# Altium schematic sheet Temp.SchDoc: main_assy PCB
size A4
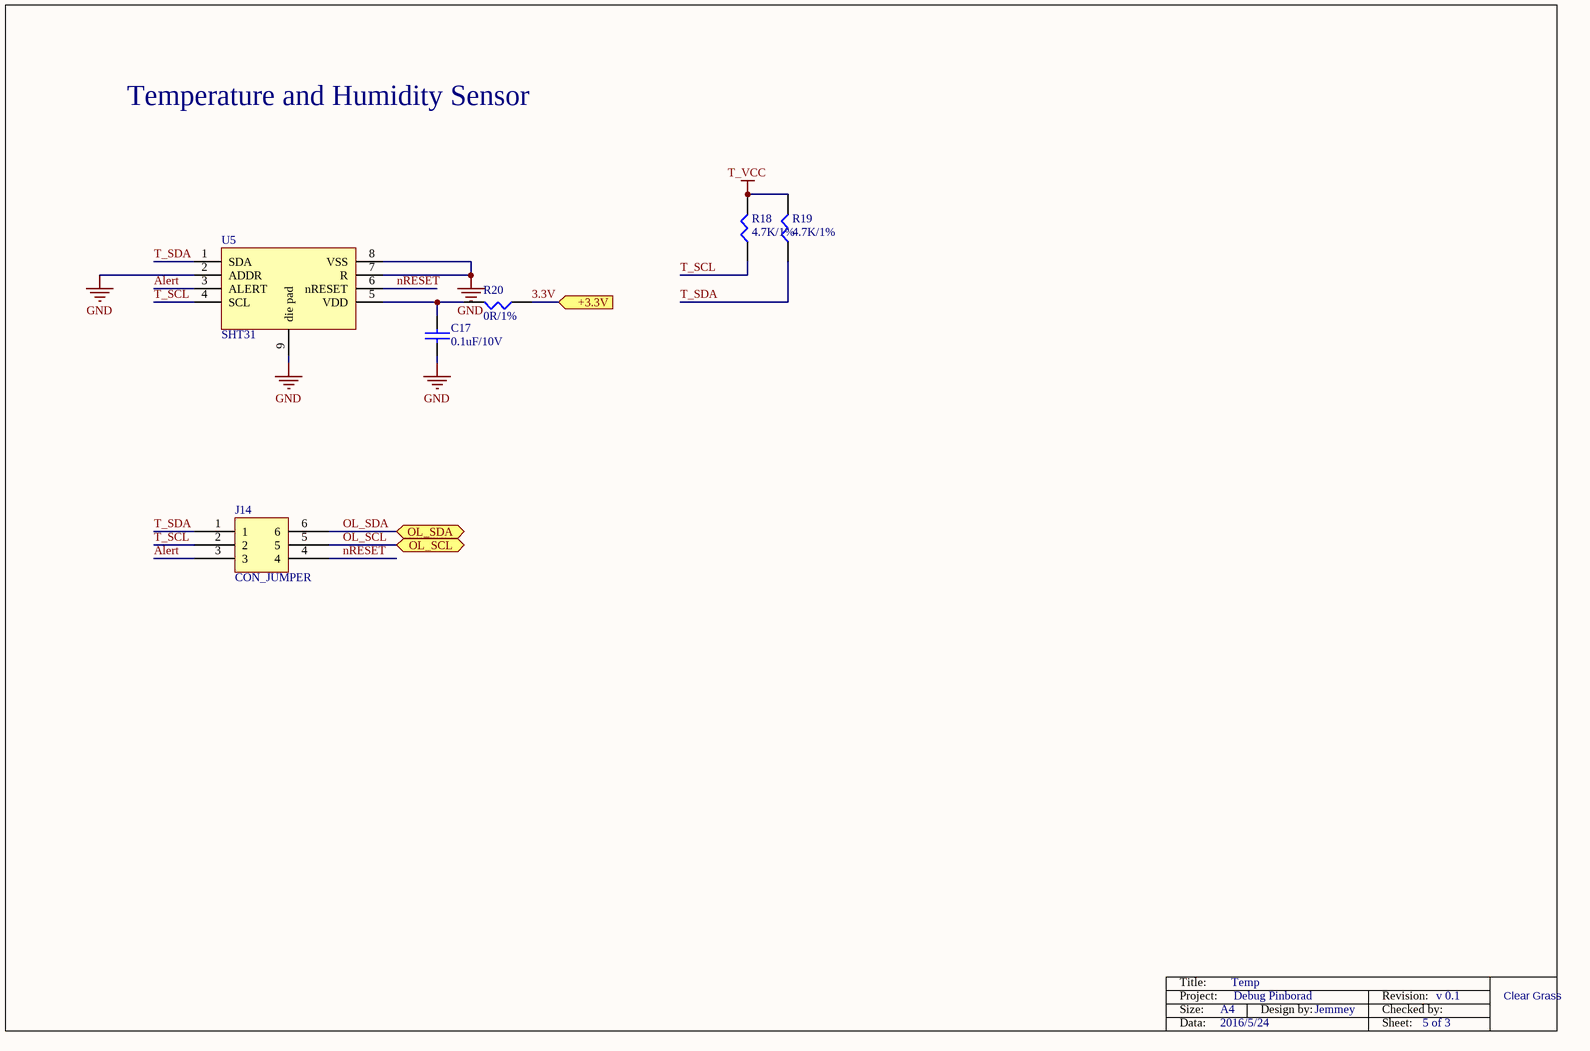
[diagram p0: Temp.SchDoc]

## Parts
C17  0.1uF/10V  [0402C]
J14  CON_JUMPER
R18  4.7K/1%  [0402R]
R19  4.7K/1%  [0402R]
R20  0R/1%  [0402R]
U5  SHT31  [DFN]

## Ports
+3.3V (in), OL_SCL (bidir), OL_SDA (bidir)

## Nets
GND: C17.2 U5.2(ADDR) U5.7(R) U5.8(VSS) U5.9(die_pad)
T_VCC: R18.2 R19.2
3.3V: R20.1 ; port +3.3V
Alert: J14.3 U5.3(ALERT)
nRESET: J14.4 U5.6(nRESET)
OL_SCL: J14.5 ; port OL_SCL
OL_SDA: J14.6 ; port OL_SDA
T_SCL: J14.2 R18.1 U5.4(SCL)
T_SDA: J14.1 R19.1 U5.1(SDA)
NetC17_1: C17.1 R20.2 U5.5(VDD)

## Notes on the sheet
- Temperature and Humidity Sensor
- Title:
- Temp
- Project:
- Size:
- Data:
- A4
- 2016/5/24
- Debug Pinborad
- Design by:
- Jemmey
- Revision:
- Sheet:
- Checked by:
- 5 of 3
- v 0.1
- Clear Grass

## Library data of the parts
C17 = CAP: 厂家：Murata，型号：GRM155R71A104KA01D
R18-R20 = RES1: 厂家：Yageo，型号：RC0402FR-0710KL
U5 = SHT31: 厂家：盛思睿，型号：SHT31